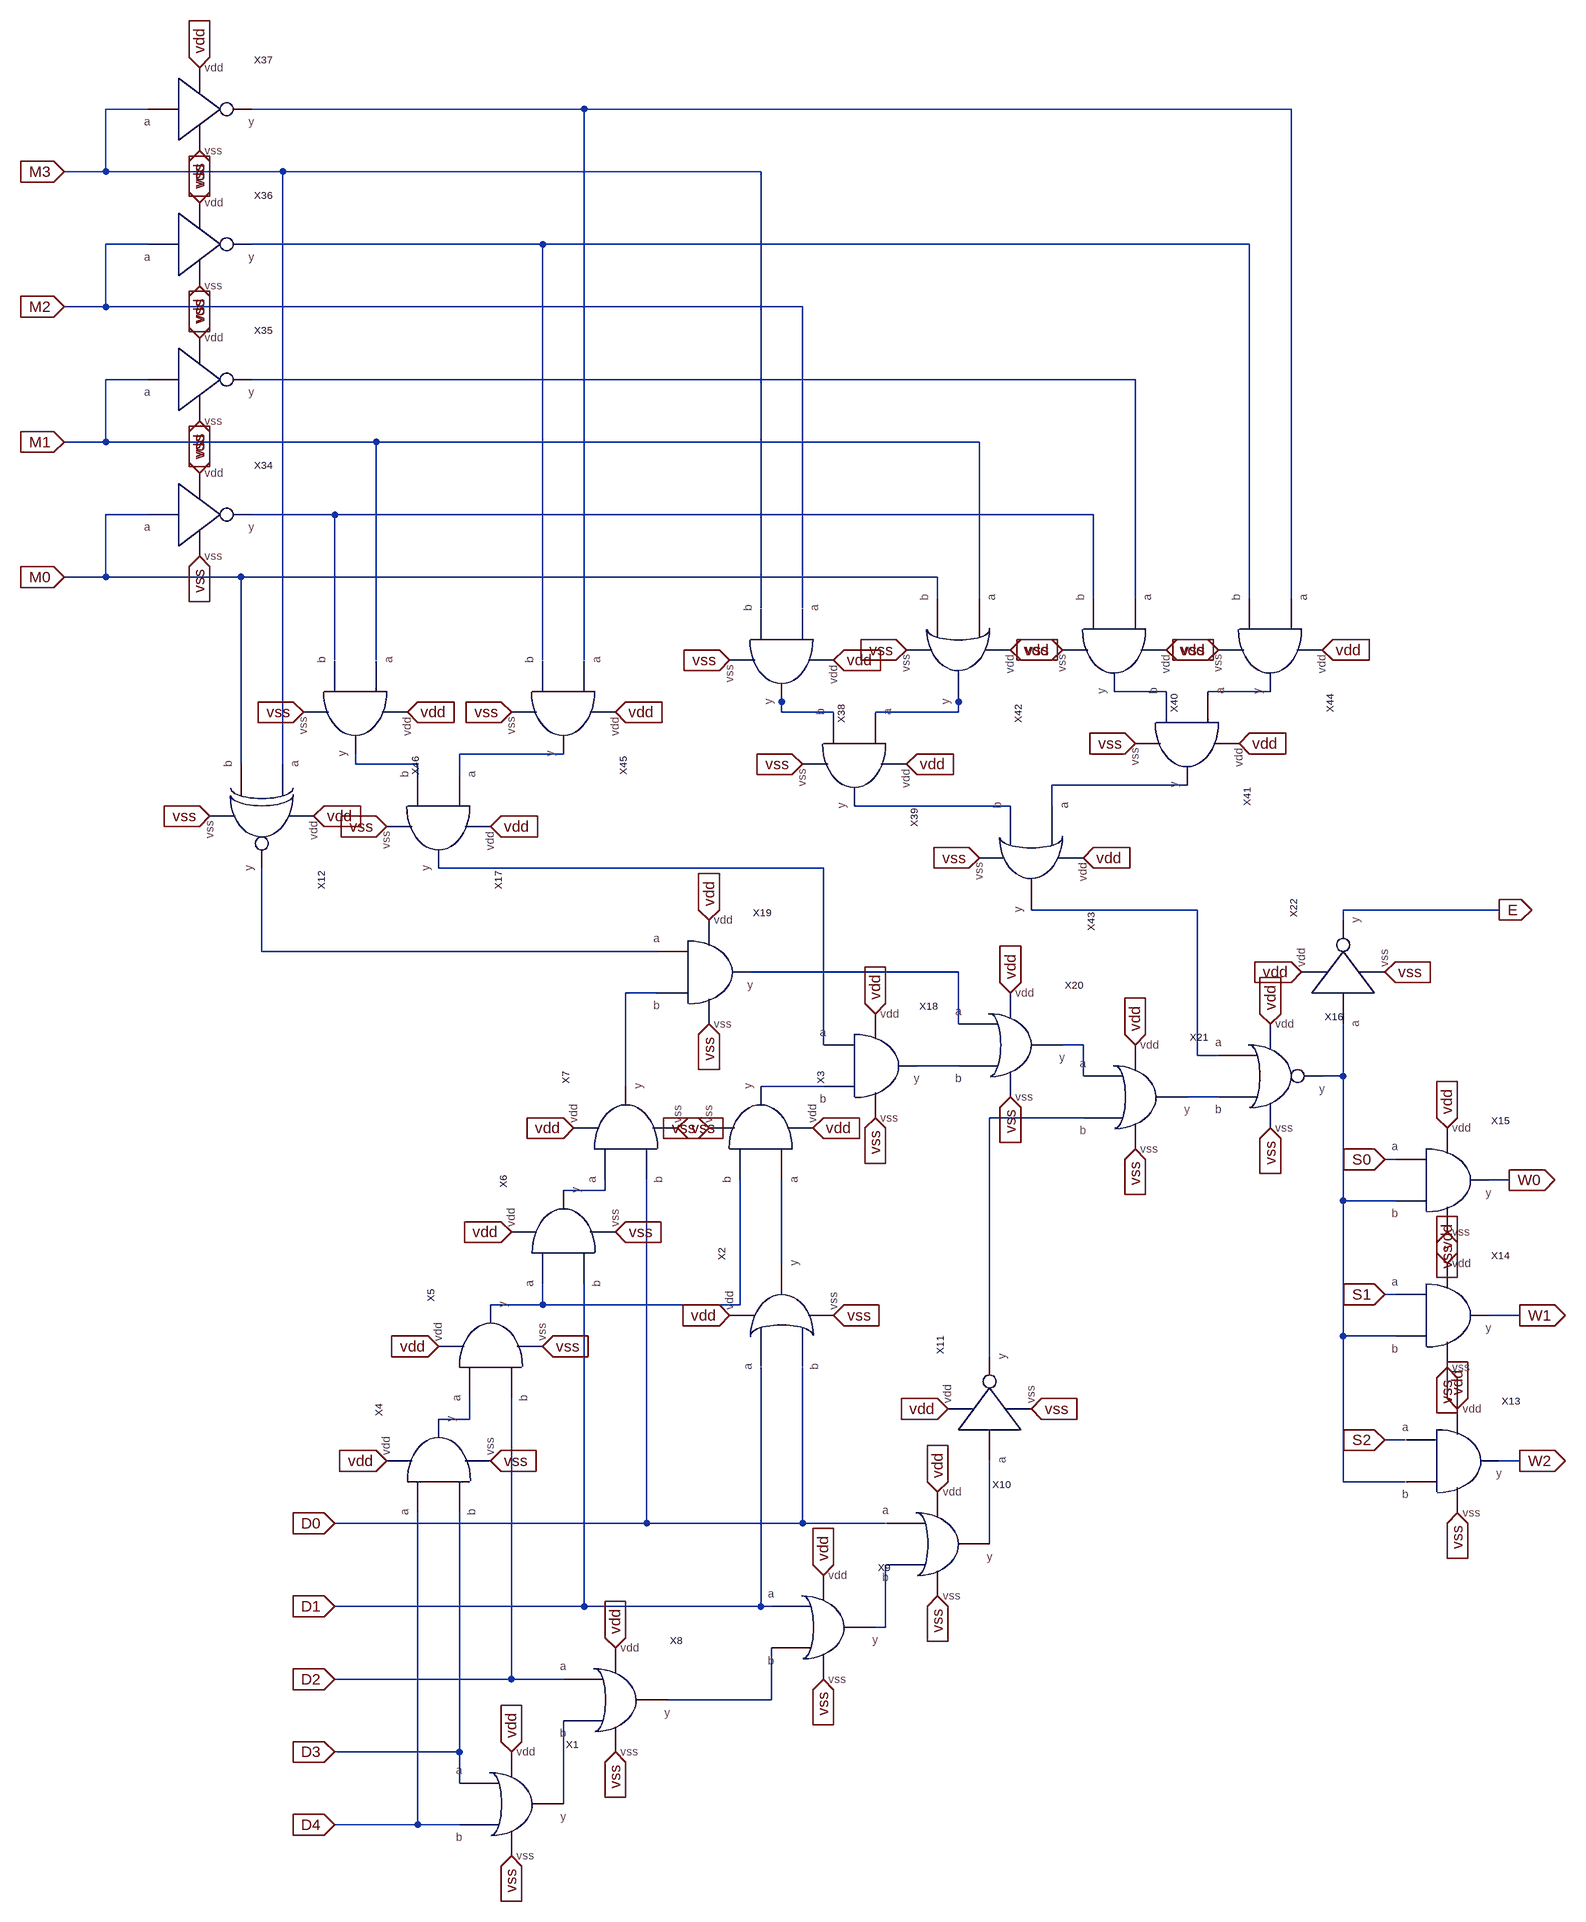
[diagram p0: schematic Error_Analyzer - Copy.asc]
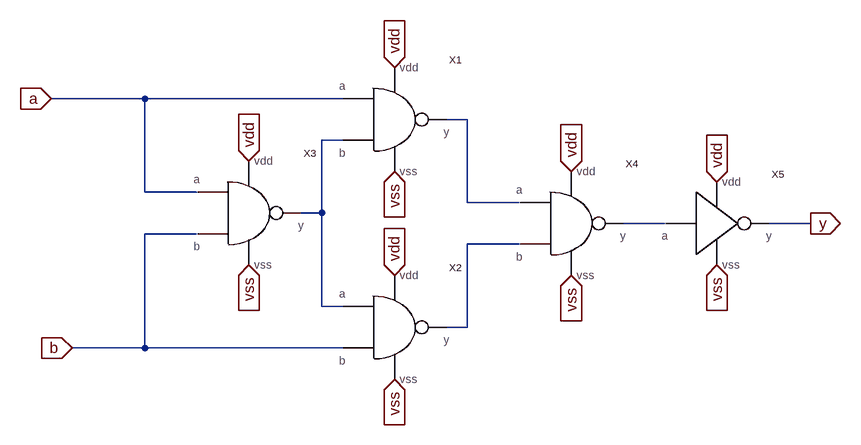
[diagram p1: sub-circuit xnor.asc]
Error_Analyzer - Copy.asc, the LTspice schematic file:
Version 4
SHEET 1 8548 2808
WIRE -3184 -960 -3248 -960
WIRE -2512 -960 -3024 -960
WIRE -1424 -960 -2512 -960
WIRE -3248 -864 -3248 -960
WIRE -3248 -864 -3312 -864
WIRE -2976 -864 -3248 -864
WIRE -2240 -864 -2976 -864
WIRE -3184 -752 -3248 -752
WIRE -2576 -752 -3024 -752
WIRE -1488 -752 -2576 -752
WIRE -3248 -656 -3248 -752
WIRE -3248 -656 -3312 -656
WIRE -2176 -656 -3248 -656
WIRE -3184 -544 -3248 -544
WIRE -1664 -544 -3024 -544
WIRE -3248 -448 -3248 -544
WIRE -3248 -448 -3312 -448
WIRE -2832 -448 -3248 -448
WIRE -1904 -448 -2832 -448
WIRE -3184 -336 -3248 -336
WIRE -2896 -336 -3024 -336
WIRE -1728 -336 -2896 -336
WIRE -3248 -240 -3248 -336
WIRE -3248 -240 -3312 -240
WIRE -3040 -240 -3248 -240
WIRE -1968 -240 -3040 -240
WIRE -1968 -208 -1968 -240
WIRE -1904 -208 -1904 -448
WIRE -1728 -208 -1728 -336
WIRE -1664 -208 -1664 -544
WIRE -1488 -208 -1488 -752
WIRE -1424 -208 -1424 -960
WIRE -2240 -192 -2240 -864
WIRE -2176 -192 -2176 -656
WIRE -2896 -112 -2896 -336
WIRE -2832 -112 -2832 -448
WIRE -2576 -112 -2576 -752
WIRE -2512 -112 -2512 -960
WIRE -1616 -64 -1696 -64
WIRE -1456 -64 -1552 -64
WIRE -2208 -48 -2208 -64
WIRE -1936 -48 -1936 -64
WIRE -2208 -32 -2208 -48
WIRE -2128 -32 -2208 -32
WIRE -1936 -32 -1936 -48
WIRE -1936 -32 -2064 -32
WIRE -2544 32 -2704 32
WIRE -3040 48 -3040 -240
WIRE -2976 48 -2976 -864
WIRE -2864 48 -2864 32
WIRE -2768 48 -2864 48
WIRE -2768 64 -2768 48
WIRE -2704 64 -2704 32
WIRE -1584 80 -1792 80
WIRE -1856 112 -2096 112
WIRE -1792 112 -1792 80
WIRE -2144 208 -2736 208
WIRE -1568 272 -1824 272
WIRE -1104 272 -1344 272
WIRE -1344 288 -1344 272
WIRE -3008 336 -3008 208
WIRE -2400 336 -3008 336
WIRE -1936 368 -2256 368
WIRE -2400 400 -2448 400
WIRE -1936 448 -1936 368
WIRE -2144 480 -2144 208
WIRE -1744 480 -1776 480
WIRE -1568 496 -1568 272
WIRE -1536 496 -1568 496
WIRE -1936 512 -2000 512
WIRE -1744 528 -1744 480
WIRE -1344 528 -1344 448
WIRE -1344 528 -1376 528
WIRE -2448 544 -2448 400
WIRE -2144 544 -2240 544
WIRE -1536 560 -1584 560
WIRE -1744 592 -1888 592
WIRE -1264 656 -1280 656
WIRE -1088 688 -1120 688
WIRE -2480 704 -2480 688
WIRE -2480 704 -2544 704
WIRE -1344 720 -1344 528
WIRE -1264 720 -1344 720
WIRE -2208 816 -2208 688
WIRE -1264 864 -1280 864
WIRE -2576 880 -2576 848
WIRE -2576 880 -2656 880
WIRE -2272 880 -2272 688
WIRE -2272 880 -2576 880
WIRE -1072 896 -1120 896
WIRE -1344 928 -1344 720
WIRE -1264 928 -1344 928
WIRE -1888 960 -1888 592
WIRE -2688 1056 -2688 1024
WIRE -2688 1056 -2736 1056
WIRE -1248 1088 -1280 1088
WIRE -1072 1120 -1104 1120
WIRE -1344 1152 -1344 928
WIRE -1248 1152 -1344 1152
WIRE -2416 1216 -2416 688
WIRE -2416 1216 -2896 1216
WIRE -2176 1216 -2176 976
WIRE -2176 1216 -2416 1216
WIRE -2048 1216 -2176 1216
WIRE -1888 1248 -1888 1120
WIRE -2512 1344 -2512 848
WIRE -2512 1344 -2896 1344
WIRE -2240 1344 -2240 976
WIRE -2240 1344 -2512 1344
WIRE -2224 1344 -2240 1344
WIRE -2048 1376 -2048 1280
WIRE -2048 1376 -2064 1376
WIRE -2624 1456 -2624 1024
WIRE -2624 1456 -2896 1456
WIRE -2544 1456 -2624 1456
WIRE -2224 1488 -2224 1408
WIRE -2224 1488 -2384 1488
WIRE -2704 1568 -2704 1200
WIRE -2704 1568 -2896 1568
WIRE -2704 1616 -2704 1568
WIRE -2544 1648 -2544 1520
WIRE -2768 1680 -2768 1200
WIRE -2768 1680 -2896 1680
WIRE -2704 1680 -2768 1680
FLAG -1104 272 E
IOPIN -1104 272 Out
FLAG -2896 1216 D0
IOPIN -2896 1216 In
FLAG -2896 1344 D1
IOPIN -2896 1344 In
FLAG -2896 1456 D2
IOPIN -2896 1456 In
FLAG -2896 1568 D3
IOPIN -2896 1568 In
FLAG -2896 1680 D4
IOPIN -2896 1680 In
FLAG -2816 1120 vdd
IOPIN -2816 1120 In
FLAG -2736 944 vdd
IOPIN -2736 944 In
FLAG -2624 768 vdd
IOPIN -2624 768 In
FLAG -2528 608 vdd
IOPIN -2528 608 In
FLAG -2368 608 vss
IOPIN -2368 608 In
FLAG -2464 768 vss
IOPIN -2464 768 In
FLAG -2576 944 vss
IOPIN -2576 944 In
FLAG -2656 1120 vss
IOPIN -2656 1120 In
FLAG -2064 592 vss
IOPIN -2064 592 In
FLAG -2064 432 vdd
IOPIN -2064 432 In
FLAG -1856 400 vdd
IOPIN -1856 400 In
FLAG -1664 480 vdd
IOPIN -1664 480 In
FLAG -1856 560 vss
IOPIN -1856 560 In
FLAG -1664 640 vss
IOPIN -1664 640 In
FLAG -3312 -240 M0
IOPIN -3312 -240 In
FLAG -3104 -400 vdd
IOPIN -3104 -400 In
FLAG -3104 -272 vss
IOPIN -3104 -272 In
FLAG -3312 -448 M1
IOPIN -3312 -448 In
FLAG -3104 -608 vdd
IOPIN -3104 -608 In
FLAG -3104 -480 vss
IOPIN -3104 -480 In
FLAG -3312 -656 M2
IOPIN -3312 -656 In
FLAG -3104 -816 vdd
IOPIN -3104 -816 In
FLAG -3104 -688 vss
IOPIN -3104 -688 In
FLAG -3312 -864 M3
IOPIN -3312 -864 In
FLAG -3104 -1024 vdd
IOPIN -3104 -1024 In
FLAG -3104 -896 vss
IOPIN -3104 -896 In
FLAG -2288 -112 vss
IOPIN -2288 -112 In
FLAG -2176 48 vss
IOPIN -2176 48 In
FLAG -2016 -128 vss
IOPIN -2016 -128 In
FLAG -1776 -128 vss
IOPIN -1776 -128 In
FLAG -1536 -128 vss
IOPIN -1536 -128 In
FLAG -1664 16 vss
IOPIN -1664 16 In
FLAG -1856 -128 vdd
IOPIN -1856 -128 In
FLAG -2016 48 vdd
IOPIN -2016 48 In
FLAG -1504 16 vdd
IOPIN -1504 16 In
FLAG -1376 -128 vdd
IOPIN -1376 -128 In
FLAG -1616 -128 vdd
IOPIN -1616 -128 In
FLAG -1744 192 vdd
IOPIN -1744 192 In
FLAG -2128 -112 vdd
IOPIN -2128 -112 In
FLAG -1904 192 vss
IOPIN -1904 192 In
FLAG -2320 448 vss
IOPIN -2320 448 In
FLAG -2320 288 vdd
IOPIN -2320 288 In
FLAG -1456 448 vdd
IOPIN -1456 448 In
FLAG -1456 608 vss
IOPIN -1456 608 In
FLAG -2784 -32 vdd
IOPIN -2784 -32 In
FLAG -2464 -32 vdd
IOPIN -2464 -32 In
FLAG -2656 144 vdd
IOPIN -2656 144 In
FLAG -2816 144 vss
IOPIN -2816 144 In
FLAG -2944 -32 vss
IOPIN -2944 -32 In
FLAG -2624 -32 vss
IOPIN -2624 -32 In
FLAG -2320 608 vss
IOPIN -2320 608 In
FLAG -2160 608 vdd
IOPIN -2160 608 In
FLAG -2128 896 vss
IOPIN -2128 896 In
FLAG -2624 1568 vdd
IOPIN -2624 1568 In
FLAG -2624 1728 vss
IOPIN -2624 1728 In
FLAG -2464 1408 vdd
IOPIN -2464 1408 In
FLAG -2464 1568 vss
IOPIN -2464 1568 In
FLAG -2144 1456 vss
IOPIN -2144 1456 In
FLAG -1968 1328 vss
IOPIN -1968 1328 In
FLAG -1824 1040 vss
IOPIN -1824 1040 In
FLAG -1952 1040 vdd
IOPIN -1952 1040 In
FLAG -1968 1168 vdd
IOPIN -1968 1168 In
FLAG -2144 1296 vdd
IOPIN -2144 1296 In
FLAG -2928 128 vdd
IOPIN -2928 128 In
FLAG -3088 128 vss
IOPIN -3088 128 In
FLAG -1280 656 S0
IOPIN -1280 656 In
FLAG -1280 864 S1
IOPIN -1280 864 In
FLAG -1280 1088 S2
IOPIN -1280 1088 In
FLAG -1184 608 vdd
IOPIN -1184 608 In
FLAG -1184 816 vdd
IOPIN -1184 816 In
FLAG -1168 1040 vdd
IOPIN -1168 1040 In
FLAG -1168 1200 vss
IOPIN -1168 1200 In
FLAG -1184 976 vss
IOPIN -1184 976 In
FLAG -1184 768 vss
IOPIN -1184 768 In
FLAG -1408 368 vdd
IOPIN -1408 368 In
FLAG -1280 368 vss
IOPIN -1280 368 In
FLAG -1088 688 W0
IOPIN -1088 688 Out
FLAG -1072 896 W1
IOPIN -1072 896 Out
FLAG -1072 1120 W2
IOPIN -1072 1120 Out
FLAG -2288 896 vdd
IOPIN -2288 896 In
SYMBOL and -2736 1120 R270
SYMATTR InstName X4
SYMBOL and -2656 944 R270
SYMATTR InstName X5
SYMBOL and -2544 768 R270
SYMATTR InstName X6
SYMBOL and -2448 608 R270
SYMATTR InstName X7
SYMBOL and -2064 512 R0
SYMATTR InstName X18
SYMBOL and -2320 368 R0
SYMATTR InstName X19
SYMBOL or -1856 480 R0
SYMATTR InstName X20
SYMBOL or -1664 560 R0
SYMATTR InstName X21
SYMBOL not -3104 -336 R0
SYMATTR InstName X34
SYMBOL not -3104 -544 R0
SYMATTR InstName X35
SYMBOL not -3104 -752 R0
SYMATTR InstName X36
SYMBOL not -3104 -960 R0
SYMATTR InstName X37
SYMBOL and -2208 -112 R90
SYMATTR InstName X38
SYMBOL and -2096 48 R90
SYMATTR InstName X39
SYMBOL or -1936 -128 R90
SYMATTR InstName X42
SYMBOL and -1696 -128 R90
SYMATTR InstName X40
SYMBOL and -1584 16 R90
SYMATTR InstName X41
SYMBOL and -1456 -128 R90
SYMATTR InstName X44
SYMBOL or -1824 192 R90
SYMATTR InstName X43
SYMBOL and -2736 144 R90
SYMATTR InstName X17
SYMBOL and -2544 -32 R90
SYMATTR InstName X45
SYMBOL and -2864 -32 R90
SYMATTR InstName X46
SYMBOL and -2240 608 M270
SYMATTR InstName X3
SYMBOL or -2624 1648 R0
SYMATTR InstName X1
SYMBOL or -2144 1376 R0
SYMATTR InstName X9
SYMBOL or -1968 1248 R0
SYMATTR InstName X10
SYMBOL or -2464 1488 R0
SYMATTR InstName X8
SYMBOL not -1888 1040 R270
SYMATTR InstName X11
SYMBOL xnor -3008 128 R90
SYMATTR InstName X12
SYMBOL and -1168 1120 R0
SYMATTR InstName X13
SYMBOL and -1184 896 R0
SYMATTR InstName X14
SYMBOL and -1184 688 R0
SYMATTR InstName X15
SYMBOL nor -1456 528 R0
SYMATTR InstName X16
SYMBOL not -1344 368 R270
SYMATTR InstName X22
SYMBOL or -2208 896 R270
SYMATTR InstName X2

xnor.asc, the sub-circuit schematic file:
Version 4
SHEET 1 1608 784
WIRE 144 128 0 128
WIRE 448 128 144 128
WIRE 640 160 608 160
WIRE 448 192 416 192
WIRE 144 272 144 128
WIRE 224 272 144 272
WIRE 640 288 640 160
WIRE 720 288 640 288
WIRE 416 304 416 192
WIRE 416 304 384 304
WIRE 944 320 880 320
WIRE 1168 320 1104 320
WIRE 224 336 144 336
WIRE 720 352 640 352
WIRE 416 448 416 304
WIRE 448 448 416 448
WIRE 640 480 640 352
WIRE 640 480 608 480
WIRE 144 512 144 336
WIRE 144 512 32 512
WIRE 448 512 144 512
FLAG 0 128 a
IOPIN 0 128 In
FLAG 1168 320 y
IOPIN 1168 320 Out
FLAG 32 512 b
IOPIN 32 512 In
FLAG 304 224 vdd
IOPIN 304 224 In
FLAG 304 384 vss
IOPIN 304 384 In
FLAG 528 80 vdd
IOPIN 528 80 In
FLAG 528 240 vss
IOPIN 528 240 In
FLAG 528 400 vdd
IOPIN 528 400 In
FLAG 528 560 vss
IOPIN 528 560 In
FLAG 800 240 vdd
IOPIN 800 240 In
FLAG 800 400 vss
IOPIN 800 400 In
FLAG 1024 256 vdd
IOPIN 1024 256 In
FLAG 1024 384 vss
IOPIN 1024 384 In
SYMBOL nand 304 304 R0
SYMATTR InstName X3
SYMBOL nand 528 160 R0
SYMATTR InstName X1
SYMBOL nand 528 480 R0
SYMATTR InstName X2
SYMBOL nand 800 320 R0
SYMATTR InstName X4
SYMBOL not 1024 320 R0
SYMATTR InstName X5

The netlist it stands for:
* Error_Analyzer - Copy.asc
XX4 D4 D3 N027 vdd vss and  ; pins a b y vdd vss
XX5 N027 D2 N026 vdd vss and  ; pins a b y vdd vss
XX6 N026 D1 N024 vdd vss and  ; pins a b y vdd vss
XX7 N024 D0 N017 vdd vss and  ; pins a b y vdd vss
XX18 N013 N021 N019 vdd vss and  ; pins a b y vdd vss
XX19 N015 N017 N016 vdd vss and  ; pins a b y vdd vss
XX20 N016 N019 N018 vdd vss or  ; pins a b y vdd vss
XX21 N018 N023 N022 vdd vss or  ; pins a b y vdd vss
XX34 M0 N004 vdd vss not  ; pins a y vdd vss
XX35 M1 N003 vdd vss not  ; pins a y vdd vss
XX36 M2 N002 vdd vss not  ; pins a y vdd vss
XX37 M3 N001 vdd vss not  ; pins a y vdd vss
XX38 M2 M3 N007 vdd vss and  ; pins a b y vdd vss
XX39 N008 N007 N012 vdd vss and  ; pins a b y vdd vss
XX42 M1 M0 N008 vdd vss or  ; pins a b y vdd vss
XX40 N003 N004 N005 vdd vss and  ; pins a b y vdd vss
XX41 N006 N005 N011 vdd vss and  ; pins a b y vdd vss
XX44 N001 N002 N006 vdd vss and  ; pins a b y vdd vss
XX43 N011 N012 N014 vdd vss or  ; pins a b y vdd vss
XX17 N009 N010 N013 vdd vss and  ; pins a b y vdd vss
XX45 N001 N002 N009 vdd vss and  ; pins a b y vdd vss
XX46 M1 N004 N010 vdd vss and  ; pins a b y vdd vss
XX3 N025 N026 N021 vdd vss and  ; pins a b y vdd vss
XX1 D3 D4 N031 vdd vss or  ; pins a b y vdd vss
XX9 D1 N030 N029 vdd vss or  ; pins a b y vdd vss
XX10 D0 N029 N028 vdd vss or  ; pins a b y vdd vss
XX8 D2 N031 N030 vdd vss or  ; pins a b y vdd vss
XX11 N028 N023 vdd vss not  ; pins a y vdd vss
XX12 M3 M0 N015 vdd vss xnor
XX13 S2 N020 W2 vdd vss and  ; pins a b y vdd vss
XX14 S1 N020 W1 vdd vss and  ; pins a b y vdd vss
XX15 S0 N020 W0 vdd vss and  ; pins a b y vdd vss
XX16 N014 N022 N020 vdd vss nor  ; pins a b y vdd vss
XX22 N020 E vdd vss not  ; pins a y vdd vss
XX2 D1 D0 N025 vdd vss or  ; pins a b y vdd vss

* block symbol definitions
.subckt xnor a b y vdd vss
XX3 a b N002 vdd vss nand  ; pins a b y vdd vss
XX1 a N002 N001 vdd vss nand  ; pins a b y vdd vss
XX2 N002 b N004 vdd vss nand  ; pins a b y vdd vss
XX4 N001 N004 N003 vdd vss nand  ; pins a b y vdd vss
XX5 N003 y vdd vss not  ; pins a y vdd vss
.ends xnor

.backanno
.end